# Altium project nanoRTDIOBoard.PrjPcb
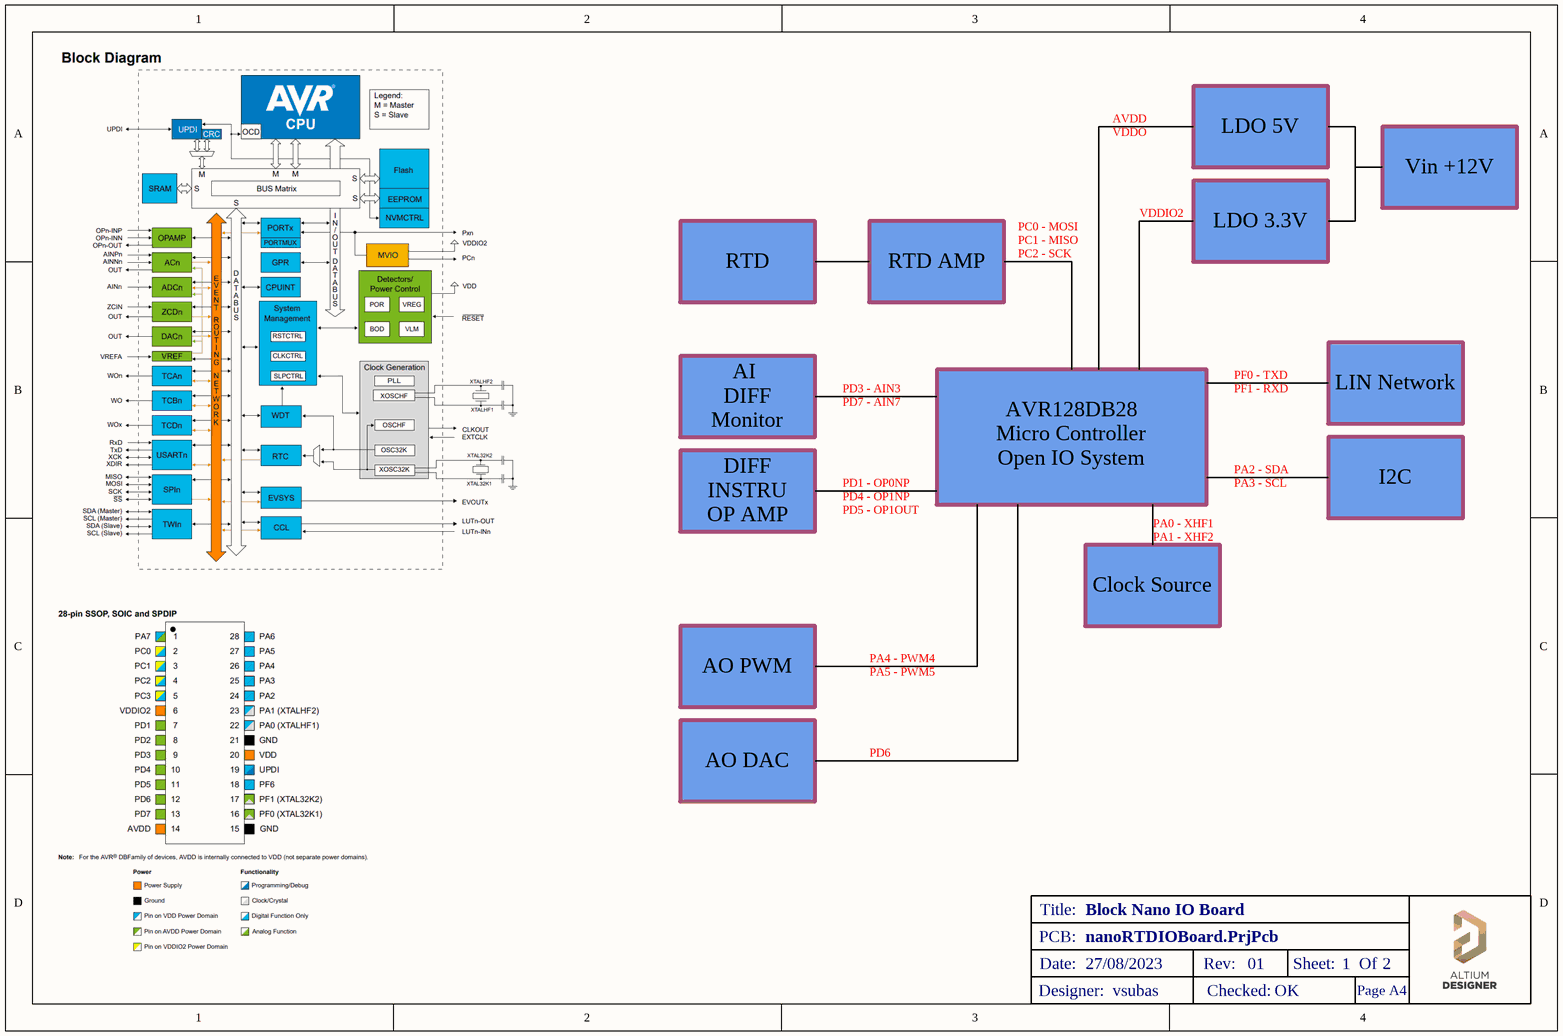
[diagram p0: blockSys.SchDoc]
2 sheets, 46 parts. Net scope: global (net labels, ports and power ports of the same name join across sheets).
Board file: board.PcbDoc
Sheets:
  blockSys.SchDoc
  mcuSch.SchDoc

## Sheet blockSys.SchDoc: Block Nano IO Board
size A4; Date: 27/08/2023; CheckedBy: OK; DrawnBy: vsubas; Engineer: vsubas; Revision: 01; SheetNumber: 1; SheetTotal: 2

### Notes on the sheet
- AVDD
- VDDO
- LDO 5V
- PC0 - MOSI
- PC1 - MISO
- VDDIO2
- Vin +12V
- RTD
- RTD AMP
- PC2 - SCK
- LDO 3.3V
- PF0 - TXD
- AI
  DIFF
  Monitor
- PD3 - AIN3
- PD7 - AIN7
- PF1 - RXD
- LIN Network
- PD1 - OP0NP
- PD5 - OP1OUT
- PD4 - OP1NP
- AVR128DB28
  Micro Controller
  Open IO System
- PA2 - SDA
- PA3 - SCL
- I2C
- DIFF
  INSTRU
  OP AMP
- PA0 - XHF1
- PA1 - XHF2
- Clock Source
- AO PWM
- PA4 - PWM4
- PA5 - PWM5
- PD6
- AO DAC
- Title:
- Date:
- PCB:
- Designer:
- Checked:
- Rev:
- Sheet:
- Of
- Page A4

## Sheet mcuSch.SchDoc: AVR DB IO BOARD
size A4; Date: 27/08/2023; CheckedBy: ok; Engineer: vsubas; Revision: 01; SheetNumber: 2; SheetTotal: 2
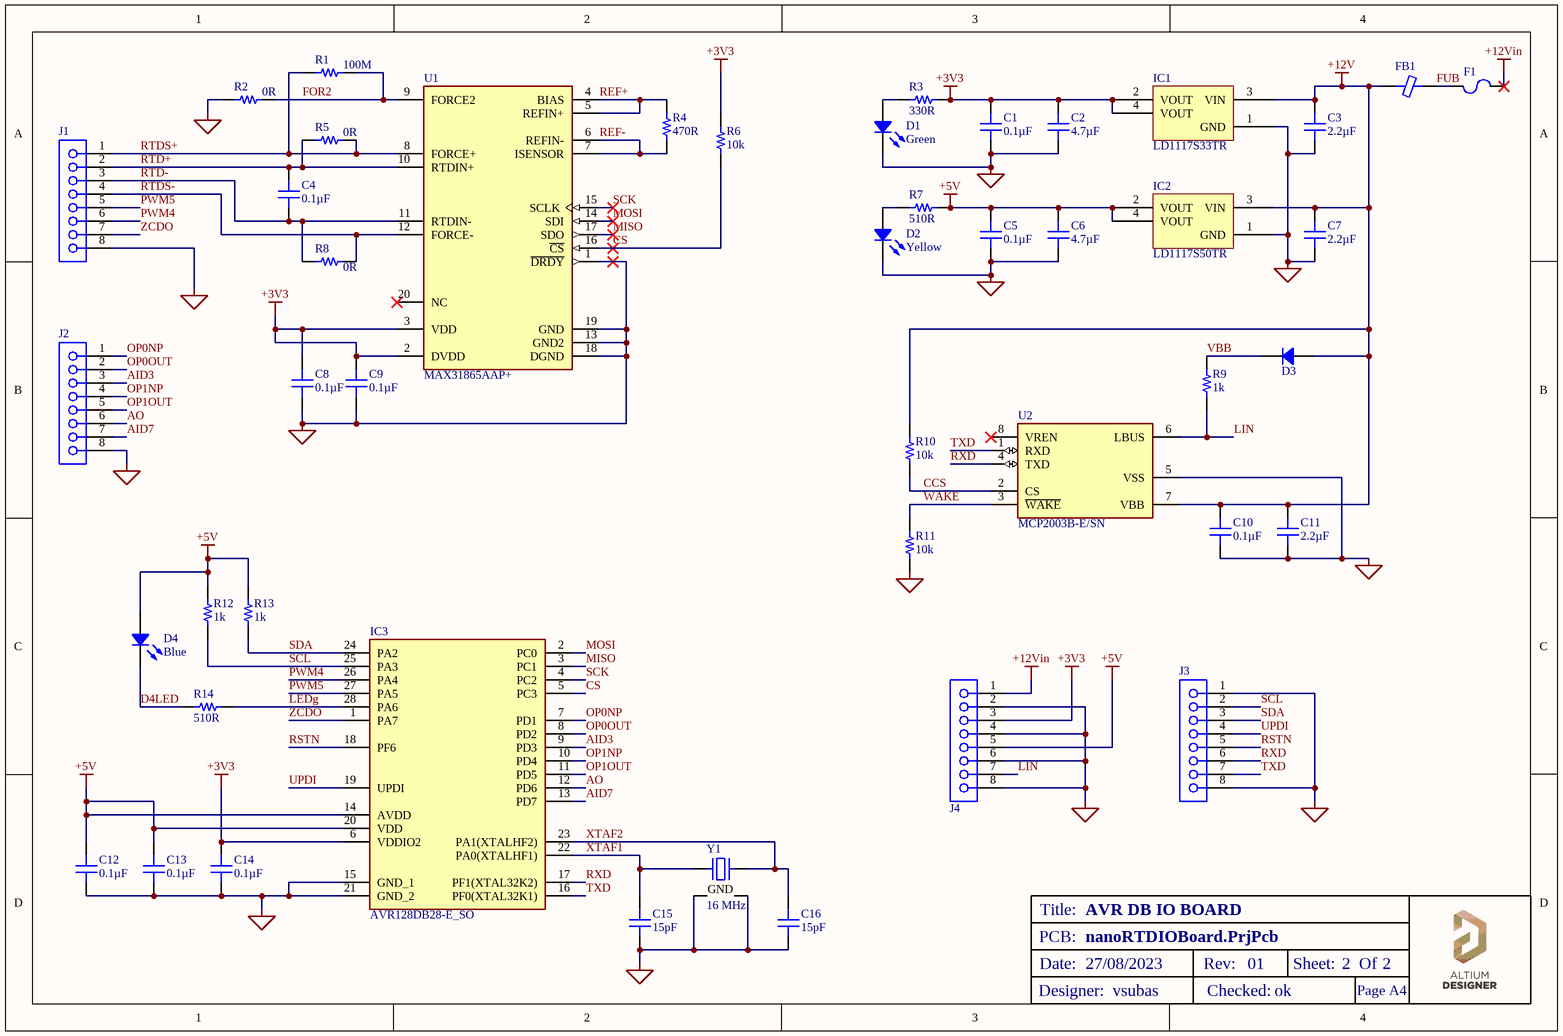
[diagram p1: mcuSch.SchDoc]

### Parts
C1  0.1µF  [CAP 0805_2012]
C2  4.7µF  [CAP 0805_2012]
C3  2.2µF  [CAP 0805_2012]
C4  0.1µF  [CAP 0805_2012]
C5  0.1µF  [CAP 0805_2012]
C6  4.7µF  [CAP 0805_2012]
C7  2.2µF  [CAP 0805_2012]
C8  0.1µF  [CAP 0805_2012]
C9  0.1µF  [CAP 0805_2012]
C10  0.1µF  [CAP 0805_2012]
C11  2.2µF  [CAP 0805_2012]
C12  0.1µF  [CAP 0805_2012]
C13  0.1µF  [CAP 0805_2012]
C14  0.1µF  [CAP 0805_2012]
C15  15pF  [CAP 0805_2012]
C16  15pF  [CAP 0805_2012]
D1  Green  [LED 0805_2012 GREEN]
D2  Yellow  [LED 0805_2012 YELLOW]
D3  RSFAL R3G  [SMF DO-219AB]  (value not drawn)
D4  Blue  [LED 0805_2012 BLUE]
F1  MFU1206FF01250P100  [FUSE 1206_3216 0.6MM]  (value not drawn)
FB1  50 Ohms @ 100 MHz  [FER 1206_3216]  (value not drawn)
IC1  LD1117S33TR  [ST SOT-223]
IC2  LD1117S50TR  [ST SOT-223]
IC3  AVR128DB28-E_SO  [SOIC127P1030X265-28N]
J1  SSQ-108-01-F-S  [SMTC-SSQ-108-01-X-S]  (value not drawn)
J2  SSQ-108-01-F-S  [SMTC-SSQ-108-01-X-S]  (value not drawn)
J3  SSQ-108-01-F-S  [SMTC-SSQ-108-01-X-S]  (value not drawn)
J4  SSQ-108-01-F-S  [SMTC-SSQ-108-01-X-S]  (value not drawn)
R1  100M  [RES 0805_2012]
R2  0R  [RES 0805_2012]
R3  330R  [RES 0805_2012]
R4  470R  [RES 0805_2012]
R5  0R  [RES 0805_2012]
R6  10k  [RES 0805_2012]
R7  510R  [RES 0805_2012]
R8  0R  [RES 0805_2012]
R9  1k  [RES 0805_2012]
R10  10k  [RES 0805_2012]
R11  10k  [RES 0805_2012]
R12  1k  [RES 0805_2012]
R13  1k  [RES 0805_2012]
R14  510R  [RES 0805_2012]
U1  MAX31865AAP+  [FP-A20-1-IPC_B]
U2  MCP2003B-E/SN  [FP-C04-057-MFG]
Y1  16 MHz  [NDK NX2520SA]

### Nets
+3V3: C1.2 C2.2 C8.2 C9.2 C14.2 IC1.2(VOUT) IC1.4(VOUT) IC3.6(VDDIO2) J4.3 R3.2 R6.2 U1.2(DVDD) U1.3(VDD)
+5V: C5.2 C6.2 C12.2 C13.2 D4.1 IC2.2(VOUT) IC2.4(VOUT) IC3.14(AVDD) IC3.20(VDD) J4.5 R7.2 R12.2 R13.2
+12V: C3.2 C7.2 C10.2 C11.2 D3.1 FB1.1 IC1.3(VIN) IC2.3(VIN) R10.2 U2.7(VBB)
+12Vin: F1.2 J4.1
GND: C1.1 C2.1 C3.1 C5.1 C6.1 C7.1 C8.1 C9.1 C10.1 C11.1 C12.1 C13.1 C14.1 C15.1 C16.1 D1.2 D2.2 IC1.1(GND) IC2.1(GND) IC3.15(GND_1) IC3.21(GND_2) J1.8 J2.8 J3.1 J3.8 J4.2 J4.4 J4.6 J4.8 R2.2 R11.1 U1.1(~{DRDY}) U1.13(GND2) U1.18(DGND) U1.19(GND) U2.5(VSS) Y1.2(GND) Y1.4(GND)
AID3: IC3.9(PD3) J2.3
AID7: IC3.13(PD7) J2.7
AO: IC3.12(PD6) J2.6
CCS: R10.1 U2.2(CS)
CS: IC3.5(PC3) R6.1 U1.16(~{CS})
D4LED: D4.2 R14.1
FOR2: R1.2 R2.1 U1.9(FORCE2)
FUB: F1.1 FB1.2
LEDg: IC3.28(PA6) R14.2
LIN: J4.7 R9.1 U2.6(LBUS)
MISO: IC3.3(PC1) U1.17(SDO)
MOSI: IC3.2(PC0) U1.14(SDI)
OP0NP: IC3.7(PD1) J2.1
OP0OUT: IC3.8(PD2) J2.2
OP1NP: IC3.10(PD4) J2.4
OP1OUT: IC3.11(PD5) J2.5
PWM4: IC3.26(PA4) J1.6
PWM5: IC3.27(PA5) J1.5
REF+: R4.2 U1.4(BIAS) U1.5(REFIN+)
REF-: R4.1 U1.6(REFIN-) U1.7(ISENSOR)
RSTN: IC3.18(PF6) J3.5
RTD+: C4.1 J1.2 R5.2 U1.10(RTDIN+)
RTD-: C4.2 J1.3 R8.2 U1.11(RTDIN-)
RTDS+: J1.1 R1.1 R5.1 U1.8(FORCE+)
RTDS-: J1.4 R8.1 U1.12(FORCE-)
RXD: IC3.17(PF1(XTAL32K2)) J3.6 U2.4(TXD)
SCK: IC3.4(PC2) U1.15(SCLK)
SCL: IC3.25(PA3) J3.2 R12.1
SDA: IC3.24(PA2) J3.3 R13.1
TXD: IC3.16(PF0(XTAL32K1)) J3.7 U2.1(RXD)
UPDI: IC3.19(UPDI) J3.4
VBB: D3.2 R9.2
WAKE: R11.2 U2.3(~{WAKE})
XTAF1: C15.2 IC3.22(PA0(XTALHF1)) Y1.1
XTAF2: C16.2 IC3.23(PA1(XTALHF2)) Y1.3
ZCDO: IC3.1(PA7) J1.7
NetD1_1: D1.1 R3.1
NetD2_1: D2.1 R7.1

Not connected (* = marked no-connect by the designer): U1 20(NC)*; U2 8(VREN)*

### Notes on the sheet
- Title:
- Date:
- PCB:
- Designer:
- Checked:
- Rev:
- Sheet:
- Of
- Page A4

### Library data of the parts
C1 C4 C5 C8-C10 C12-C14 = 08053C104JAT4A: CAP CER 0.1UF 25V X7R 0805; manufacturer: AVX Corporation; Tolerance: ±5%; Part Number: 08053C104JAT4A; Value: 0.1µF; Applications: General Purpose; Capacitance: 0.1µF; componentlink1description: Datasheet; componentlink1url: http://datasheets.avx.com/X7RDielectric.pdf; componentlink2description: DigiKey Link; componentlink2url: http://digikey.com/product-detail/en/avx-corporation/08053C104JAT4A/478-13051-1-ND/9948569; Device Package: 0805 (2012 Metric); lastupdated: 2/09/2020 1:04:39 AM; Lifecycle Status: Active; Minimum Order: 1; Mounting Type: Surface Mount, MLCC; Operating Temperature: -55°C ~ 125°C; Package / Case: 0805 (2012 Metric); packaging: TapeAndReel; partid: 3721; Part Status: Active; price: 0.04; series: -; Size / Dimension: 0.079" L x 0.049" W (2.01mm x 1.25mm); Supplier 1: DigiKey; Supplier Part Number 1: 478-13051-1-ND; Temperature Coefficient: X7R; Thickness (Max): 0.037" (0.94mm); Voltage - Rated: 25V
C2 C6 = CL21A475KBQNNNE: CAP CER 4.7UF 50V X5R 0805; manufacturer: Samsung Electro-Mechanics; Tolerance: ±10%; Part Number: CL21A475KBQNNNE; Value: 4.7µF; Applications: General Purpose; Capacitance: 4.7µF; componentlink1description: Datasheet; componentlink1url: http://www.samsungsem.com/kr/support/product-search/mlcc/CL21A475KBQNNNE.jsp; componentlink2description: DigiKey Link; componentlink2url: https://www.digikey.com/en/products/detail/samsung-electro-mechanics/CL21A475KBQNNNE/3886906; Device Package: 0805 (2012 Metric); lastupdated: 21/03/2023 7:12:38 PM; Lifecycle Status: Active; Minimum Order: 1; Mounting Type: Surface Mount, MLCC; Operating Temperature: -55°C ~ 85°C; Package / Case: 0805 (2012 Metric); packaging: TapeAndReel; partid: 3027; Part Status: Active; price: 0.03; series: CL; Size / Dimension: 0.079" L x 0.049" W (2.00mm x 1.25mm); Supplier 1: DigiKey; Supplier Part Number 1: 1276-1248-1-ND; Temperature Coefficient: X5R; Thickness (Max): 0.055" (1.40mm); Voltage - Rated: 50V
C3 C7 C11 = CL21A225KB9LNNC: CAP CER 2.2UF 50V X5R 0805; manufacturer: Samsung Electro-Mechanics; Tolerance: ±10%; Part Number: CL21A225KB9LNNC; Value: 2.2µF; Applications: General Purpose; Capacitance: 2.2µF; componentlink1description: Datasheet; componentlink1url: http://www.samsungsem.com/kr/support/product-search/mlcc/CL21A225KB9LNNC.jsp; componentlink2description: DigiKey Link; componentlink2url: https://www.digikey.com/en/products/detail/samsung-electro-mechanics/CL21A225KB9LNNC/3888067; Device Package: 0805 (2012 Metric); Features: Low Profile; lastupdated: 21/03/2023 7:12:38 PM; Lifecycle Status: Active; Minimum Order: 1; Mounting Type: Surface Mount, MLCC; Operating Temperature: -55°C ~ 85°C; Package / Case: 0805 (2012 Metric); packaging: TapeAndReel; partid: 3097; Part Status: Active; price: 0.04; series: CL; Size / Dimension: 0.079" L x 0.049" W (2.00mm x 1.25mm); Supplier 1: DigiKey; Supplier Part Number 1: 1276-2409-1-ND; Temperature Coefficient: X5R; Thickness (Max): 0.039" (1.00mm); Voltage - Rated: 50V
C15 C16 = 08055A150GAT2A: CAP CER 15PF 50V NP0 0805; manufacturer: AVX Corporation; Temperature Coefficient: C0G, NP0; Tolerance: ±2%; Part Number: 08055A150GAT2A; Value: 15pF; Applications: General Purpose; Capacitance: 15pF; componentlink1description: Datasheet; componentlink1url: http://datasheets.avx.com/C0GNP0-Dielectric.pdf; componentlink2description: DigiKey Link; componentlink2url: http://digikey.com/product-detail/en/avx-corporation/08055A150GAT2A/478-11884-1-ND/8573520; Device Package: 0805 (2012 Metric); lastupdated: 2/09/2020 1:04:39 AM; Lifecycle Status: Active; Minimum Order: 1; Mounting Type: Surface Mount, MLCC; Operating Temperature: -55°C ~ 125°C; Package / Case: 0805 (2012 Metric); packaging: TapeAndReel; partid: 3968; Part Status: Active; price: 0.10; series: -; Size / Dimension: 0.079" L x 0.049" W (2.01mm x 1.25mm); Supplier 1: DigiKey; Supplier Part Number 1: 478-11884-1-ND; Thickness (Max): 0.037" (0.94mm); Voltage - Rated: 50V
D1 = QTLP630C4TR: LED GREEN CLEAR 0805 SMD; Manufacturer: Everlight Electronics Co Ltd; Configuration: Standard; Current - Test: 20mA; Lens Color: Colorless; Lens Size: 1.40mm x 1.25mm; Lens Style: Rectangle with Flat Top; Millicandela Rating: 10mcd; Viewing Angle: 140°; Voltage - Forward (Vf) (Typ): 2.1V; Wavelength - Dominant: 570nm; Wavelength - Peak: 565nm; Part Number: QTLP630C4TR; Color: Green; ComponentLink1Description: Datasheet; ComponentLink1URL: //media.digikey.com/PDF/Data%20Sheets/Everlight%20PDFs/QTLP630-2.pdf; ComponentLink2Description: DigiKey Link; ComponentLink2URL: https://www.digikey.com/en/products/detail/everlight-electronics-co-ltd/QTLP630C4TR/2675902; Device Package: 0805 (2012 Metric); Height (Max): 1.20mm; LastUpdated: 7/04/2023 8:00:35 PM; Lens Transparency: Clear; Lifecycle Status: Active; Minimum Order: 1; Mounting Type: Surface Mount; Package / Case: 0805 (2012 Metric); Packaging: TapeAndReel; PartId: 240; Part Status: Active; Price: 0.04; Series: -; Size / Dimension: 2.00mm L x 1.25mm W; Supplier 1: DigiKey; Supplier Part Number 1: 1080-1411-1-ND; Supplier Device Package: 0805; Value: Green
D2 = VAOL-S8YP4: LED YELLOW CLEAR 0805 SMD; Manufacturer: Visual Communications Company - VCC; Configuration: Standard; Current - Test: 20mA; Lens Color: Colorless; Lens Size: 1.40mm x 1.25mm; Lens Style: Rectangle with Flat Top; Millicandela Rating: 92mcd; Viewing Angle: 140°; Voltage - Forward (Vf) (Typ): 2V; Wavelength - Dominant: 589nm; Wavelength - Peak: 591nm; Part Number: VAOL-S8YP4; Color: Yellow; ComponentLink1Description: Datasheet; ComponentLink1URL: http://vcclite.com/_pdf/VAOL-S8YP4-LED-0805-yellow.pdf; ComponentLink2Description: DigiKey Link; ComponentLink2URL: http://digikey.com/product-detail/en/visual-communications-company-vcc/VAOL-S8YP4/VAOL-S8YP4CT-ND/5176155; Device Package: 0805 (2012 Metric); Height (Max): 1.30mm; LastUpdated: 21/03/2023 8:00:35 PM; Lens Transparency: Clear; Lifecycle Status: Active; Minimum Order: 1; Mounting Type: Surface Mount; Package / Case: 0805 (2012 Metric); Packaging: TapeAndReel; PartId: 40; Part Status: Active; Price: 0.08; Series: -; Size / Dimension: 2.00mm L x 1.25mm W; Supplier 1: DigiKey; Supplier Part Number 1: VAOL-S8YP4CT-ND; Supplier Device Package: 0805; Value: Yellow
D3 = RSFAL R3G: DIODE GEN PURP 50V 500MA SUB SMA; Manufacturer: Taiwan Semiconductor Corporation; Capacitance @ Vr, F: 4pF @ 4V, 1MHz; Current - Reverse Leakage @ Vr: 5µA @ 50V; Diode Type: Standard; Reverse Recovery Time (trr): 150ns; Speed: Fast Recovery =< 500ns, > 200mA (Io); Voltage - Forward (Vf) (Max) @ If: 1.3V @ 500mA; Part Number: RSFAL R3G; ComponentLink1Description: Datasheet; ComponentLink1URL: https://www.taiwansemi.com/products/datasheet/RSFAL%20SERIES_L15.pdf; ComponentLink2Description: DigiKey Link; ComponentLink2URL: http://digikey.com/product-detail/en/taiwan-semiconductor-corporation/RSFAL-R3G/RSFALR3GCT-ND/7358188; Current - Average Rectified (Io): 500mA; LastUpdated: 11/04/2023 8:03:34 PM; Lifecycle Status: Active; Minimum Order: 1; Mounting Type: Surface Mount; Operating Temperature - Junction: -55°C ~ 150°C; Package / Case: DO-219AB; Packaging: TapeAndReel; PartId: 1240; Part Status: Active; Price: 0.07; Series: -; Supplier 1: DigiKey; Supplier Part Number 1: RSFALR3GCT-ND; Supplier Device Package: Sub SMA; Voltage - DC Reverse (Vr) (Max): 50V
D4 = 5973605607F: LED BLUE 0805 SMD; Manufacturer: Dialight; Configuration: Standard; Current - Test: 2mA; Lens Color: 0.93mm; Lens Size: 1.40mm x 1.25mm; Lens Style: Rectangle with Flat Top; Millicandela Rating: 15mcd; Viewing Angle: 130°; Voltage - Forward (Vf) (Typ): 2.8V; Wavelength - Peak: 468nm; Part Number: 5973605607F; Color: Blue; ComponentLink1Description: Datasheet; ComponentLink1URL: http://www.dialightsignalsandcomponents.com/Assets/Drawings/2D_Drawings_DrawingDetailedSpec/NewDrawings/18375A.pdf; ComponentLink2Description: DigiKey Link; ComponentLink2URL: https://www.digikey.com/en/products/detail/dialight/5973605607F/9385449; Device Package: 0805 (2012 Metric); Height (Max): 1.10mm; LastUpdated: 8/04/2023 8:00:14 PM; Lifecycle Status: Active; Minimum Order: 1; Mounting Type: Surface Mount; Package / Case: 0805 (2012 Metric); Packaging: TapeAndReel; PartId: 760; Part Status: Active; Price: 0.08; Series: 597; Size / Dimension: 2.00mm L x 1.25mm W; Supplier 1: DigiKey; Supplier Part Number 1: 350-4394-1-ND; Supplier Device Package: 0805; Value: Blue
F1 = MFU1206FF01250P100: FUSE BOARD MNT 1.25A 63VDC 1206; Manufacturer: Vishay Beyschlag; Approval Agency: UL; Breaking Capacity @ Rated Voltage: 50A; Fuse Type: Board Mount (Cartridge Style Excluded); Melting I²t: 0.0041; Response Time: Fast Blow; Voltage Rating - DC: 63V; Part Number: MFU1206FF01250P100; Approvals: UL; ComponentLink1Description: Datasheet; ComponentLink1URL: http://www.vishay.com/docs/28747/mfuserie.pdf; ComponentLink2Description: DigiKey Link; ComponentLink2URL: http://digikey.com/product-detail/en/vishay-beyschlag/MFU1206FF01250P100/MFU12061.25CT-ND/1206562; Current Rating (Amps): 1.25A; Device Package: 1206 (3216 Metric); LastUpdated: 2/09/2020 1:30:46 AM; Lifecycle Status: Active; Minimum Order: 1; Mounting Type: Surface Mount; Operating Temperature: -55°C ~ 125°C; Package / Case: 1206 (3216 Metric); Packaging: TapeAndReel; Part Status: Active; Price: 0.30; Series: MFU; Size / Dimension: 0.126" L x 0.063" W x 0.022" H (3.20mm x 1.60mm x 0.55mm); Supplier 1: DigiKey; Supplier Part Number 1: MFU12061.25CT-ND
FB1 = MFBW1V3216-500-R: FERRITE BEAD 50 OHM 1206 1LN; Manufacturer: Eaton - Electronics Division; Current Rating (Max): 3A; DC Resistance (DCR) (Max): 70mOhm; Number of Lines: 1; Part Number: MFBW1V3216-500-R; ComponentLink1Description: Datasheet; ComponentLink1URL: https://www.eaton.com/content/dam/eaton/products/electronic-components/resources/data-sheet/eaton-mfbw1v3216-high-impedance-multilayer-ferrite-chip-bead-data-sheet.pdf; ComponentLink2Description: DigiKey Link; ComponentLink2URL: https://www.digikey.com/en/products/detail/eaton-electronics-division/MFBW1V3216-500-R/13161315; Device Package: 1206 (3216 Metric); Height (Max): 0.043" (1.10mm); Impedance @ Frequency: 50 Ohms @ 100 MHz; LastUpdated: 7/04/2023 7:54:11 PM; Lifecycle Status: Active; Minimum Order: 1; Mounting Type: Surface Mount; Operating Temperature: -40°C ~ 85°C; Package / Case: 1206 (3216 Metric); Packaging: TapeAndReel; PartId: 3259; Part Status: Active; Price: 0.03; Series: MFBW1V3216; Size / Dimension: 0.126" L x 0.063" W (3.20mm x 1.60mm); Supplier 1: DigiKey; Supplier Part Number 1: 283-MFBW1V3216-500-RCT-ND; Value: 50 Ohms @ 100 MHz
IC1 = LD1117S33TR: IC REG LINEAR 3.3V 800MA SOT223; Manufacturer: STMicroelectronics; Current - Quiescent (Iq): 10 mA; Number of Regulators: 1; Output Configuration: Positive; Output Type: Fixed; Protection Features: Over Current, Over Temperature; PSRR: 75dB (120Hz); Voltage Dropout (Max): 1.2V @ 800mA; Voltage - Input (Max): 15V; Part Number: LD1117S33TR; ComponentLink1Description: Datasheet; ComponentLink1URL: http://www.st.com/content/ccc/resource/technical/document/datasheet/99/3b/7d/91/91/51/4b/be/CD00000544.pdf/files/CD00000544.pdf/jcr:content/translations/en.CD00000544.pdf; ComponentLink2Description: DigiKey Link; ComponentLink2URL: https://www.digikey.com/en/products/detail/stmicroelectronics/LD1117S33TR/585766; Current - Output: 800mA; LastUpdated: 7/04/2023 8:08:42 PM; Lifecycle Status: Active; Minimum Order: 1; Mounting Type: Surface Mount; Operating Temperature: 0°C ~ 125°C; Package / Case: TO-261-4, TO-261AA; Packaging: TapeAndReel; Part Status: Active; Price: 0.21; Series: -; Supplier 1: DigiKey; Supplier Part Number 1: 497-1242-1-ND; Supplier Device Package: SOT-223; Voltage - Output (Min/Fixed): 3.3V
IC2 = LD1117S50TR: IC REG LINEAR 5V 800MA SOT223; Manufacturer: STMicroelectronics; Current - Quiescent (Iq): 10 mA; Number of Regulators: 1; Output Configuration: Positive; Output Type: Fixed; Protection Features: Over Current, Over Temperature; PSRR: 75dB (120Hz); Voltage Dropout (Max): 1.2V @ 800mA; Voltage - Input (Max): 15V; Part Number: LD1117S50TR; ComponentLink1Description: Datasheet; ComponentLink1URL: http://www.st.com/content/ccc/resource/technical/document/datasheet/99/3b/7d/91/91/51/4b/be/CD00000544.pdf/files/CD00000544.pdf/jcr:content/translations/en.CD00000544.pdf; ComponentLink2Description: DigiKey Link; ComponentLink2URL: https://www.digikey.com/en/products/detail/stmicroelectronics/LD1117S50TR/1038360; Current - Output: 800mA; LastUpdated: 7/04/2023 8:08:42 PM; Lifecycle Status: Active; Minimum Order: 1; Mounting Type: Surface Mount; Operating Temperature: 0°C ~ 125°C; Package / Case: TO-261-4, TO-261AA; Packaging: TapeAndReel; Part Status: Active; Price: 0.21; Series: -; Supplier 1: DigiKey; Supplier Part Number 1: 497-6447-1-ND; Supplier Device Package: SOT-223; Voltage - Output (Min/Fixed): 5V
IC3 = AVR128DB28-E_SO: Integrated Circuit; Manufacturer_Name: Microchip; Manufacturer_Part_Number: AVR128DB28-E/SO; Datasheet Link: https://www.mouser.com/catalog/specsheets/mchp-s-a0011111973-1.pdf; Height: 2.65mm; Mouser Part Number: 579-AVR128DB28-E/SO; Mouser Price/Stock: https://www.mouser.co.uk/ProductDetail/Microchip-Technology-Atmel/AVR128DB28-E-SO?qs=vmHwEFxEFR%252BlBMYhZgyarQ%3D%3D
J1-J4 = CMP-1023-00294-1: SQ Post Socket, Through-hole, Vertical, -55 to 125 degC, 2.54 mm Pitch, 8-Pin, Female, RoHS; Manufacturer: Samtec; Pitch: 2.54 mm; ComponentLink3URL: http://www.samtec.com/documents/webfiles/cpdf/SSQ-1XX-XX-XXX-X-XX-XXX-XX-X-MKT.pdf; ComponentLink2URL: http://www.samtec.com/documents/webfiles/pdf/SSQ_TH.PDF; Mounting Technology: Through-hole; PackageReference: SSQ-108-01-X-S; Orientation: Vertical; PackageDescription: Assembly, Socket Strip .025[0.64] SQ Tail; ComponentLink2Description: Datasheet; PartNumber: SSQ-108-01-F-S; Temperature Range: -55 to 125 degC; ComponentLink1URL: http://www.samtec.com; ComponentLink3Description: Package Specification; PackageVersion: BD, 6/1987; RoHS: True; ComponentLink1Description: Manufacturer URL; DatasheetVersion: F-214
R1 = HVCB0805FDC100M: RES 100M OHM 1% 1/5W 0805; Manufacturer: Stackpole Electronics Inc; Power (Watts): 0.2W, 1/5W; Temperature Coefficient: ±50ppm/°C; Part Number: HVCB0805FDC100M; Value: 100M; ComponentLink1Description: Datasheet; ComponentLink1URL: https://www.seielect.com/catalog/sei-hvc.pdf; ComponentLink2Description: DigiKey Link; ComponentLink2URL: https://www.digikey.com/en/products/detail/stackpole-electronics-inc/HVCB0805FDC100M/4696447; Composition: Thick Film; Device Package: 0805 (2012 Metric); Features: High Voltage, Moisture Resistant, Pulse Withstanding; Height - Seated (Max): 0.025" (0.64mm); LastUpdated: 29/03/2023 7:43:09 PM; Lifecycle Status: Active; Minimum Order: 1; Number of Terminations: 2; Operating Temperature: -55°C ~ 150°C; Package / Case: 0805 (2012 Metric); Packaging: TapeAndReel; PartId: 34607; Part Status: Active; Price: 2.45; Resistance: 100M; Series: HVC; Size / Dimension: 0.079" L x 0.050" W (2.01mm x 1.27mm); Supplier 1: DigiKey; Supplier Part Number 1: HVCB0805FDC100MCT-ND; Supplier Device Package: 0805; Tolerance: ±1%
R2 R5 R8 = TLRZ2ATTD: RES 0 OHM JUMPER 0805; Manufacturer: KOA Speer Electronics, Inc.; Part Number: TLRZ2ATTD; Value: 0R; ComponentLink1Description: Datasheet; ComponentLink1URL: http://www.koaspeer.com/catimages/Products/TLRZ/TLRZ.pdf; ComponentLink2Description: DigiKey Link; ComponentLink2URL: https://www.digikey.com/en/products/detail/koa-speer-electronics-inc/TLRZ2ATTD/9845494; Composition: Metal Element; Device Package: 0805 (2012 Metric); Features: Automotive AEC-Q200, Current Sense; Height - Seated (Max): 0.022" (0.55mm); LastUpdated: 29/03/2023 7:43:37 PM; Lifecycle Status: Active; Minimum Order: 1; Number of Terminations: 2; Operating Temperature: -55°C ~ 170°C; Package / Case: 0805 (2012 Metric); Packaging: TapeAndReel; PartId: 27685; Part Status: Active; Price: 0.08; Ratings: AEC-Q200; Resistance: 0R; Series: TLRZ; Size / Dimension: 0.079" L x 0.049" W (2.00mm x 1.25mm); Supplier 1: DigiKey; Supplier Part Number 1: 2019-TLRZ2ATTDCT-ND; Supplier Device Package: 0805; Tolerance: Jumper
R3 = CRCW0805330RFKEAHP: RES SMD 330 OHM 1% 1/2W 0805; Manufacturer: Vishay Dale; Power (Watts): 0.5W, 1/2W; Temperature Coefficient: ±100ppm/°C; Part Number: CRCW0805330RFKEAHP; Value: 330R; ComponentLink1Description: Datasheet; ComponentLink1URL: http://www.vishay.com/docs/20043/crcwhpe3.pdf; ComponentLink2Description: DigiKey Link; ComponentLink2URL: https://www.digikey.com/en/products/detail/vishay-dale/CRCW0805330RFKEAHP/2226912; Composition: Thick Film; Device Package: 0805 (2012 Metric); Features: Automotive AEC-Q200, Pulse Withstanding; Height - Seated (Max): 0.020" (0.50mm); LastUpdated: 7/04/2023 7:45:00 PM; Lifecycle Status: Active; Minimum Order: 1; Number of Terminations: 2; Operating Temperature: -55°C ~ 155°C; Package / Case: 0805 (2012 Metric); Packaging: TapeAndReel; PartId: 30364; Part Status: Active; Price: 0.03; Ratings: AEC-Q200; Resistance: 330R; Series: CRCW-HP; Size / Dimension: 0.079" L x 0.049" W (2.00mm x 1.25mm); Supplier 1: DigiKey; Supplier Part Number 1: 541-330TCT-ND; Supplier Device Package: 0805; Tolerance: ±1%
R4 = ERJ-PB6B4700V: RES SMD 470 OHM 0.1% 1/4W 0805; Manufacturer: Panasonic Electronic Components; Power (Watts): 0.25W, 1/4W; Temperature Coefficient: ±50ppm/°C; Part Number: ERJ-PB6B4700V; Value: 470R; ComponentLink1Description: Datasheet; ComponentLink1URL: https://industrial.panasonic.com/cdbs/www-data/pdf/RDM0000/AOA0000C328.pdf; ComponentLink2Description: DigiKey Link; ComponentLink2URL: https://www.digikey.com/en/products/detail/panasonic-electronic-components/ERJ-PB6B4700V/6213339; Composition: Thick Film; Device Package: 0805 (2012 Metric); Features: Automotive AEC-Q200, Pulse Withstanding; Height - Seated (Max): 0.028" (0.70mm); LastUpdated: 29/03/2023 7:43:34 PM; Lifecycle Status: Active; Minimum Order: 1; Number of Terminations: 2; Operating Temperature: -55°C ~ 155°C; Package / Case: 0805 (2012 Metric); Packaging: TapeAndReel; PartId: 28402; Part Status: Active; Price: 0.04; Ratings: AEC-Q200; Resistance: 470R; Series: ERJ-PB6; Size / Dimension: 0.079" L x 0.049" W (2.00mm x 1.25mm); Supplier 1: DigiKey; Supplier Part Number 1: P20556CT-ND; Supplier Device Package: 0805; Tolerance: ±0.1%
R6 R10 R11 = RNCS0805BKE10K0: RES 10K OHM 0.1% 1/10W 0805; Manufacturer: Stackpole Electronics Inc; Power (Watts): 0.1W, 1/10W; Temperature Coefficient: ±25ppm/°C; Part Number: RNCS0805BKE10K0; Value: 10k; ComponentLink1Description: Datasheet; ComponentLink1URL: https://www.seielect.com/catalog/sei-rncs_rnch.pdf; ComponentLink2Description: DigiKey Link; ComponentLink2URL: https://www.digikey.com/en/products/detail/stackpole-electronics-inc/RNCS0805BKE10K0/1800067; Composition: Thin Film; Device Package: 0805 (2012 Metric); Features: Anti-Corrosive, Automotive AEC-Q200, Moisture Resistant; Height - Seated (Max): 0.026" (0.65mm); Lifecycle Status: Active; Minimum Order: 1; Number of Terminations: 2; Operating Temperature: -55°C ~ 155°C; Package / Case: 0805 (2012 Metric); Packaging: TapeAndReel; PartId: 27713; Part Status: Active; Ratings: AEC-Q200; Resistance: 10k; Series: RNCS; Size / Dimension: 0.079" L x 0.049" W (2.00mm x 1.25mm); Supplier 1: DigiKey; Supplier Part Number 1: RNCS0805BKE10K0CT-ND; Supplier Device Package: 0805; Tolerance: ±0.1%
  R6: LastUpdated: 29/03/2023 7:43:37 PM; Price: 0.09
  R10 R11: LastUpdated: 23/04/2023 7:51:08 PM; Price: 0.07
R7 R14 = ERJ-6ENF5100V: RES SMD 510 OHM 1% 1/8W 0805; Manufacturer: Panasonic Electronic Components; Power (Watts): 0.125W, 1/8W; Temperature Coefficient: ±100ppm/°C; Part Number: ERJ-6ENF5100V; Value: 510R; ComponentLink1Description: Datasheet; ComponentLink1URL: https://industrial.panasonic.com/cdbs/www-data/pdf/RDA0000/AOA0000C304.pdf; ComponentLink2Description: DigiKey Link; ComponentLink2URL: https://www.digikey.com/en/products/detail/panasonic-electronic-components/ERJ-6ENF5100V/1746512; Composition: Thick Film; Device Package: 0805 (2012 Metric); Features: Automotive AEC-Q200; Height - Seated (Max): 0.028" (0.70mm); LastUpdated: 7/04/2023 7:45:01 PM; Lifecycle Status: Active; Minimum Order: 1; Number of Terminations: 2; Operating Temperature: -55°C ~ 155°C; Package / Case: 0805 (2012 Metric); Packaging: TapeAndReel; PartId: 30157; Part Status: Active; Price: 0.01; Ratings: AEC-Q200; Resistance: 510R; Series: ERJ-6EN; Size / Dimension: 0.079" L x 0.049" W (2.00mm x 1.25mm); Supplier 1: DigiKey; Supplier Part Number 1: P510CCT-ND; Supplier Device Package: 0805; Tolerance: ±1%
R9 R12 R13 = RNCS0805BKE1K00: RES 1K OHM 0.1% 1/10W 0805; Manufacturer: Stackpole Electronics Inc; Power (Watts): 0.1W, 1/10W; Temperature Coefficient: ±25ppm/°C; Part Number: RNCS0805BKE1K00; Value: 1k; ComponentLink1Description: Datasheet; ComponentLink1URL: https://www.seielect.com/catalog/sei-rncs_rnch.pdf; ComponentLink2Description: DigiKey Link; ComponentLink2URL: https://www.digikey.com/en/products/detail/stackpole-electronics-inc/RNCS0805BKE1K00/1800073; Composition: Thin Film; Device Package: 0805 (2012 Metric); Features: Anti-Corrosive, Automotive AEC-Q200, Moisture Resistant; Height - Seated (Max): 0.026" (0.65mm); LastUpdated: 21/03/2023 7:44:30 PM; Lifecycle Status: Active; Minimum Order: 1; Number of Terminations: 2; Operating Temperature: -55°C ~ 155°C; Package / Case: 0805 (2012 Metric); Packaging: TapeAndReel; PartId: 27715; Part Status: Active; Price: 0.09; Ratings: AEC-Q200; Resistance: 1k; Series: RNCS; Size / Dimension: 0.079" L x 0.049" W (2.00mm x 1.25mm); Supplier 1: DigiKey; Supplier Part Number 1: RNCS0805BKE1K00CT-ND; Supplier Device Package: 0805; Tolerance: ±0.1%
U1 = CMP-014-00003-4: MAX31865 Series 3.3 V RTD-to-Digital Converter - SSOP-20
U2 = CMP-015-00015-1: LIN Transceiver with Integrated Vreg 20kBd Automotive 8-Pin SOIC N Tube
Y1 = NX2520SA-16MHZ-EXS00A-CS05116: CRYSTAL 16.0000MHZ 12PF SMD; Manufacturer: NDK America, Inc.; ESR (Equivalent Series Resistance): 80 Ohms; Frequency Stability: ±15ppm; Operating Mode: Fundamental; Part Number: NX2520SA-16MHZ-EXS00A-CS05116; ComponentLink1Description: Datasheet; ComponentLink1URL: //media.digikey.com/pdf/Data%20Sheets/NDK%20PDFs/NX2520SA-16MHZ-EXS00A-CS05116.pdf; ComponentLink2Description: DigiKey Link; ComponentLink2URL: https://www.digikey.com/en/products/detail/ndk-america-inc/NX2520SA-16MHZ-EXS00A-CS05116/3894065; Frequency: 16 MHz; Frequency Tolerance: ±15ppm; Height - Seated (Max): 0.022" (0.55mm); LastUpdated: 21/03/2023 8:01:10 PM; Lifecycle Status: Active; Load Capacitance: 12pF; Minimum Order: 1; Mounting Type: Surface Mount; Operating Temperature: -10°C ~ 75°C; Package / Case: 4-SMD, No Lead; Packaging: TapeAndReel; PartId: 522; Part Status: Active; Price: 0.77; Series: NX2520SA; Size / Dimension: 0.098" L x 0.079" W (2.50mm x 2.00mm); Supplier 1: DigiKey; Supplier Part Number 1: 644-1200-1-ND; Type: MHz Crystal; Value: 16 MHz